# EAGLE design FreedomPort (EAGLE 9.6.2)
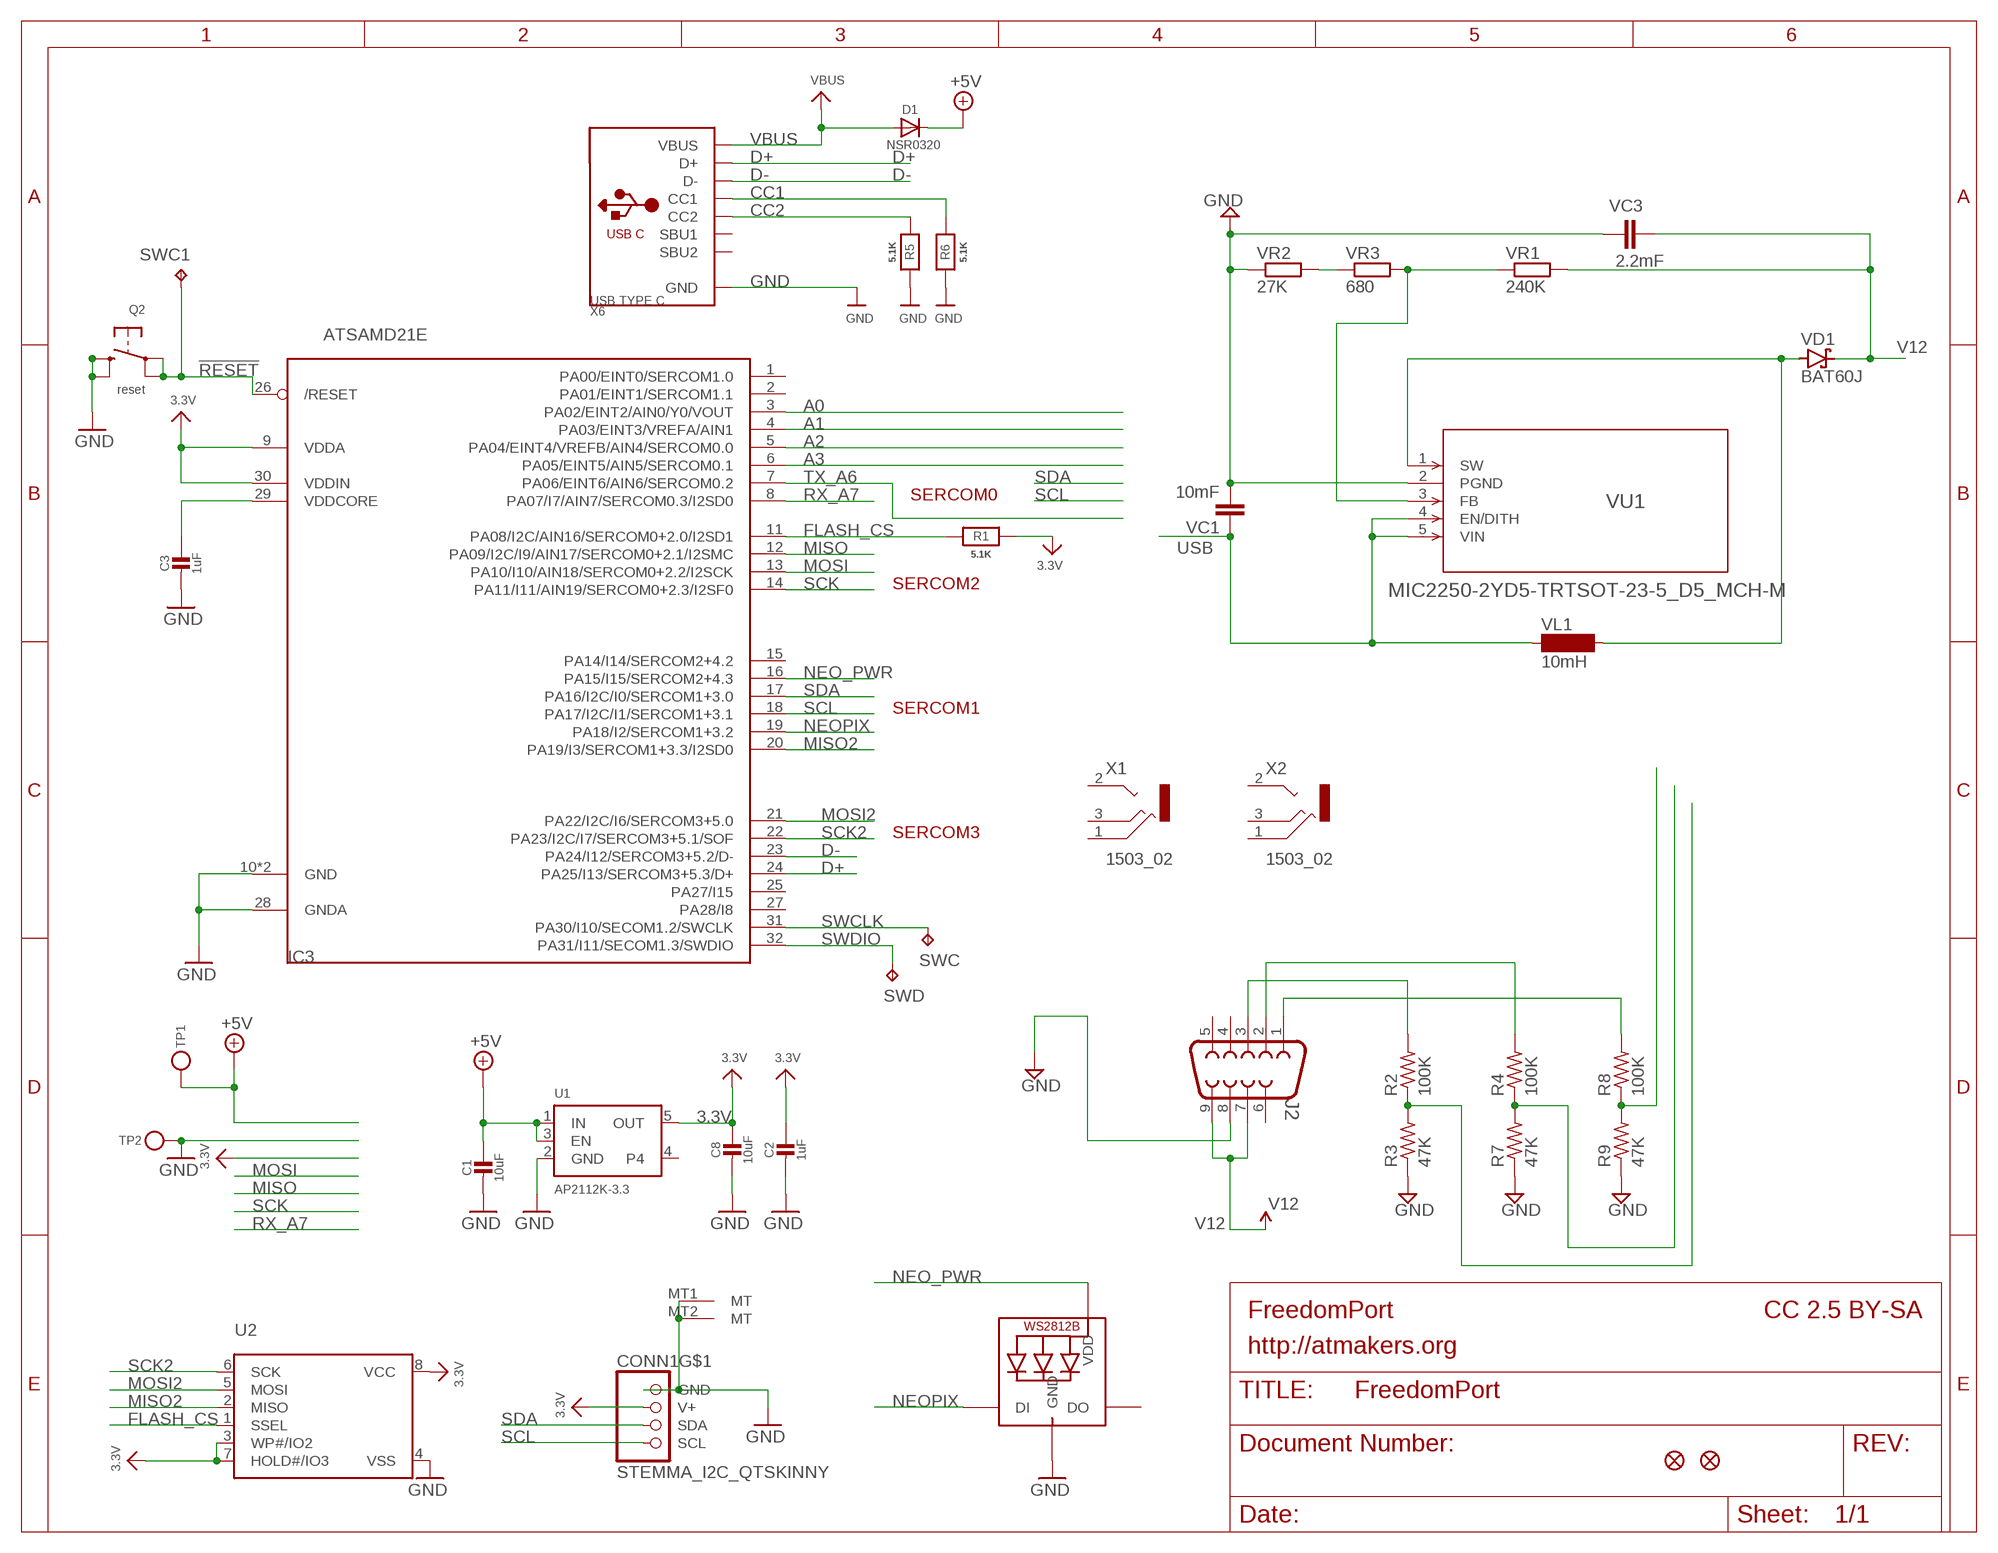
[diagram p0: schematic, sheet 1]

## Parts
C1  10uF  CAP_CERAMIC_0805MP  [_0805MP]
C2  1uF  CAP_CERAMIC_0402NO  [_0402NO]
C3  1uF  CAP_CERAMIC_0402NO  [_0402NO]
C8  10uF  CAP_CERAMIC_0805MP  [_0805MP]
CONN1  STEMMA_I2C_QTSKINNY  [JST_SH4_SKINNY]
D1  NSR0320  DIODE_SOD323MINI  [SOD-323_MINI]
IC3  ATSAMD21E  [QFN32_5MM]
J2  DB9MALE  [DB9_MALE]
LED1  WS2812B_SK6805_1515  [SK6805_1515]
Q2  reset  SWITCH_TACT_SMT4.6X2.8  [BTN_KMR2_4.6X2.8]
R1  5.1K  RESISTOR_0402NO  [_0402NO]
R2  100K  R-US_R0805  [R0805]
R3  47K  R-US_R0805  [R0805]
R4  100K  R-US_R0805  [R0805]
R5  5.1K  RESISTOR_0402NO  [_0402NO]
R6  5.1K  RESISTOR_0402NO  [_0402NO]
R7  47K  R-US_R0805  [R0805]
R8  100K  R-US_R0805  [R0805]
R9  47K  R-US_R0805  [R0805]
SWC  TPB1,27  [B1,27]
SWC1  TPB1,27  [B1,27]
SWD  TPB1,27  [B1,27]
TP1  TESTPOINT_1X3  [TESTPOINT_RECT_1X3MM]
TP2  TESTPOINT_1X3  [TESTPOINT_RECT_1X3MM]
U1  AP2112K-3.3  VREG_SOT23-5  [SOT23-5]
U2  SPIFLASH_8PIN  [SOIC8_150MIL]
U$6  FIDUCIAL_1MM  [FIDUCIAL_1MM]
U$8  FIDUCIAL_1MM  [FIDUCIAL_1MM]
VC1  10mF  C-EUC0805  [C0805]
VC3  2.2mF  C-EUC0805  [C0805]
VD1  BAT60J  [SOD323_ST]
VL1  10mH  MS50  [MS50]
VR1  240K  R-EU_R0805W  [R0805W]
VR2  27K  R-EU_R0805W  [R0805W]
VR3  680  R-EU_R0805W  [R0805W]
VU1  MIC2250-2YD5-TRTSOT-23-5_D5_MCH-M  [TSOT-23-5_D5_MCH-M]
X1  1503_02  [1503_02]
X2  1503_02  [1503_02]
X6  USB TYPE C  USB_C  [USB_C_CUSB31-CFM2AX-01-X]

## Nets
3.3V [power]: C2.1 C8.1 CONN1.2(V+) IC3.9(VDDA) IC3.30(VDDIN) R1.1 U1.5(OUT) U2.3(WP#/IO2) U2.7(HOLD#/IO3) U2.8(VCC)
!RESET: IC3.26(/RESET) Q2.A'(P1) Q2.A(P) SWC1.TP
+5V [power]: C1.1 D1.C TP1.P$1 U1.1(IN) U1.3(EN)
A0: IC3.3(PA02/EINT2/AIN0/Y0/VOUT)
A1: IC3.4(PA03/EINT3/VREFA/AIN1)
A2: IC3.5(PA04/EINT4/VREFB/AIN4/SERCOM0.0)
A3: IC3.6(PA05/EINT5/AIN5/SERCOM0.1)
CC1: R6.2 X6.A5(CC1)
CC2: R5.2 X6.B5(CC2)
D+: IC3.24(PA25/I13/SERCOM3+5.3/D+) X6.A6(D+) X6.B6(D+)
D-: IC3.23(PA24/I12/SERCOM3+5.2/D-) X6.A7(D-) X6.B7(D-)
FLASH_CS: IC3.11(PA08/I2C/AIN16/SERCOM0+2.0/I2SD1) R1.2 U2.1(SSEL)
GND [power]: C1.2 C2.2 C3.2 C8.2 CONN1.1(GND) CONN1.MT1(MT) CONN1.MT2(MT) IC3.10(GND) IC3.28(GNDA) IC3.33(GND) J2.8 LED1.4(GND) Q2.B'(S1) Q2.B(S) R3.1 R5.1 R6.1 R7.1 R9.1 TP2.P$1 U1.2(GND) U2.4(VSS) VC1.2 VC3.1 VR2.1 VU1.2(PGND) X6.A1B12(GND) X6.B1A12(GND)
MISO: IC3.12(PA09/I2C/I9/AIN17/SERCOM0+2.1/I2SMC)
MISO2: IC3.20(PA19/I3/SERCOM1+3.3/I2SD0) U2.2(MISO)
MOSI: IC3.13(PA10/I10/AIN18/SERCOM0+2.2/I2SCK)
MOSI2: IC3.21(PA22/I2C/I6/SERCOM3+5.0) U2.5(MOSI)
N$1: J2.3 R2.2
N$5: R2.1 R3.2
N$6: R4.1 R7.2
N$7: R8.1 R9.2
N$8: VR1.1 VR3.2 VU1.3(FB)
N$9: J2.2 R4.2
N$10: J2.1 R8.2
N$26: VD1.A VL1.2 VU1.1(SW)
N$31: VR2.2 VR3.1
NEO_PWR: IC3.16(PA15/I15/SERCOM2+4.3) LED1.2(VDD)
NEOPIX: IC3.19(PA18/I2/SERCOM1+3.2) LED1.1(DI)
RX_A7: IC3.8(PA07/I7/AIN7/SERCOM0.3/I2SD0)
SCK: IC3.14(PA11/I11/AIN19/SERCOM0+2.3/I2SF0)
SCK2: IC3.22(PA23/I2C/I7/SERCOM3+5.1/SOF) U2.6(SCK)
SCL: CONN1.4(SCL) IC3.18(PA17/I2C/I1/SERCOM1+3.1)
SDA: CONN1.3(SDA) IC3.17(PA16/I2C/I0/SERCOM1+3.0)
SWCLK: IC3.31(PA30/I10/SECOM1.2/SWCLK) SWC.TP
SWDIO: IC3.32(PA31/I11/SECOM1.3/SWDIO) SWD.TP
TX_A6: IC3.7(PA06/EINT6/AIN6/SERCOM0.2)
USB: VC1.1 VL1.1 VU1.4(EN/DITH) VU1.5(VIN)
V12: J2.7 J2.9 VC3.2 VD1.C VR1.2
VBUS [power]: D1.A X6.A4B9(VBUS) X6.B4A9(VBUS)
VDDCORE: C3.1 IC3.29(VDDCORE)
Unconnected: IC3.1(PA00/EINT0/SERCOM1.0) IC3.2(PA01/EINT1/SERCOM1.1) IC3.15(PA14/I14/SERCOM2+4.2) IC3.25(PA27/I15) IC3.27(PA28/I8) J2.4 J2.5 J2.6 LED1.3(DO) U1.4 X1.1 X1.2 X1.2@2 X1.3 X2.1 X2.2 X2.2@2 X2.3 X6.A8(SBU1) X6.B8(SBU2)

## Notes on the sheet
- SERCOM0
- SERCOM2
- SERCOM1
- SERCOM3
- FreedomPort | CC 2.5 BY-SA
- http://atmakers.org

## Library data of the parts
C1-C3 C8 = microbuilder:CAP_CERAMIC: Ceramic Capacitors For new designs, use the packages preceded by an '_' character since they are more reliable: The following footprints should be used on most boards: _0402 - Standard footprint for regular board layouts _0603 - Standard footprint for regular board layouts _0805 - Standard footprint for regular board layouts _1206 - Standard footprint for regular board layouts For extremely tight-pitch boards where space is at a premium, the following 'micro-pitch' footprints can be used (smaller pads, no silkscreen outline, etc.): _0402MP - Micro-pitch footprint for very dense/compact boards _0603MP - Micro-pitch footprint for very dense/compact boards _0805MP - Micro-pitch footprint for very dense/compact boards _1206MP - Micro-pitch footprint for very dense/compact boards
CONN1 = microbuilder:STEMMA_I2C
D1 = microbuilder:DIODE: Diode SMA Model Volts Amps Type Vf Ir Digikey # Notes SSA34-E3 40V 3A Schottky 480mV @ 3A 200uA @ 40V SSA34-E3/61TGITR-ND CDBA120-G 20V 1A Schottky 500mV @ 1A 500uA @ 20V 641-1014-6-ND REEL MBRA210 10V 2A Schottky 350mV @ 2A 700uA @ 10V MBRA210LT3 SOD-123 Model Volts Amps Type Vf Ir Order # Notes BAT54T1G 30V 200mA Schottky 800mV @ 200mA 2uA @ 25V BAT54T1GOSTR-ND B0530W 30V 500mA Schottky 430mV @ 500mA 130uA @ 30V B0530W-FDICT-ND REEL MBR120 20V 1A Schottky 340mV @ 1A MBR120VLSFT1GOSCT-ND SOD-323 Model Volts Amps Type Vf Ir Order # Notes PMEG2005EJ 20V 500mA Schottky 355mV @ 500mA 568-4110-1-ND ZLLS410 10V 570mA Schottky 380mV @ 570mA ZLLS410CT-ND 1N4148WS 75V 150mA Silicon/Simple 1V 1N4148WSFSCT-ND REEL SOD-523 Model Volts Amps Type Vf Ir Order # Notes BAT54XV2 30V 200mA Schottky 0.8V @ 100mA BAT54XV2CT-ND TB751S 30V 30mA Schottky RB751S-40TE61CT-ND SOT23-R/W (R = Solder Paste/Reflow Ovens, W = Hand-Soldering) Model Volts Amps Type Vf Ir Order # Notes BAT54FILM 40V 300mA Schottky 497-7162-1-ND POWERDI-5 Model Volts Amps Type Vf Ir Order # Notes PDS560 60V 5A Schottky 670mV @ 5A 150uA @ 60V PDS560DICT-ND
IC3 = adafruit_micro:ATSAMD21E
J2 = SparkFun-Connectors:DB9: DB9 Connector Standard DB9 (D-Sub 9) serial connector. Can be used for CAN bus as well as RS485 and RS232. Footprint production proven. Here is the female version connector we sell at SparkFun: 9 Pin Female Serial Connector - PCB Mount <https://www.sparkfun.com/products/429> (PRT-00429) This connector has been used on the following SparkFun products: SparkFun RS232 Shifter - SMD <https://www.sparkfun.com/products/449> (PRT-00449) SparkFun RS232 Shifter SMD (No DB9) <https://www.sparkfun.com/products/8780> (PRT-08780); PROD_ID: CONN-09904
LED1 = microbuilder:WS2812B
Q2 = microbuilder:SWITCH_TACT_SMT: SMT Tact Switches 6x6mm - Digikey: P12940SCT-ND KMR2 (4.6x2.8mm) - Digikey: 401-1426-1-ND EVQ-PQHB55 - Light Touch, 160GF (4.5x4.5mm) - Digikey: P8090SCT-ND KMT0 - KMT021 NGJ LHS (etc.) IP68/Waterproof - Digikey: CKN10289CT-ND
R1 R5 R6 = microbuilder:RESISTOR: Resistors For new designs, use the packages preceded by an '_' character since they are more reliable: The following footprints should be used on most boards: _0402 - Standard footprint for regular board layouts _0603 - Standard footprint for regular board layouts _0805 - Standard footprint for regular board layouts _1206 - Standard footprint for regular board layouts For extremely tight-pitch boards where space is at a premium, the following 'micro-pitch' footprints can be used (smaller pads, no silkscreen outline, etc.): _0402MP - Micro-pitch footprint for very dense/compact boards _0603MP - Micro-pitch footprint for very dense/compact boards _0805MP - Micro-pitch footprint for very dense/compact boards _1206MP - Micro-pitch footprint for very dense/compact boards
R2-R4 R7-R9 = adafruit:R-US_: RESISTOR, American symbol
SWC SWC1 SWD = testpad:TP: Test pad
TP1 TP2 = microbuilder:TESTPOINT: Test Point Various test points for characterisation and PCB testing TESTPOINT_SMT - Compact Surface Mount Test Point [Digikey: 5016KTR-ND]
U1 = adafruit_power:VREG_SOT23-5: SOT23-5 Fixed Voltage Regulators Part Current Out V Out V In V Dropout θJA (°C/W) TJ (°C) Digikey Part No. ADP121 150mA 3.3V 3.4-5.5V 0.09V @ 150mA -- -- ADP121-AUJZ33R7CT-ND ADP121 150mA 3.0V 3.1-5.5V 0.09V @ 150mA -- -- ADP121-AUJZ30R7CT-ND ADP122 300mA 3.3V 3.4-5.5V 0.085V @ 300mA -- -- ADP122AUJZ-3.3-R7CT-ND ADP1712 300mA 3.3V 3.5-5.5V 0.17V @ 300mA -- -- ADP1712AUJZ-3.3-R7TR-ND AP7311 (Low Cost) 150mA 3.3V 3.5-6V 0.15V @ 150mA -- -- AP7311-33WG-7DICT-ND LD39015M18R 150mA 1.8V 1.9V-5.5V 0.08V @ 100mA -- -- 497-6977-1-ND LP2985A-33DBVR 150mA 3.3V 3.3-16V 0.28V @ 150mA 206 150 296-18479-1-ND MCP1824T-3302E/OT 300mA 3.3V 3.5V-6V 0.2V @ 300mA -- -- MCP1824T-3302E/OTCT-ND MIC5205-2.5YM5 TR 150mA 2.5V 2.7-16V 0.165V @ 150mA -- -- 576-1257-2-ND MIC5205-3.0YM5 TR 150mA 3.0V 3.2V-16V 0.165V @ 150mA -- -- 576-1258-2-ND MIC5205-3.3YM5 TR 150mA 3.3V 3.5V-16V 0.165V @ 150mA -- -- 576-1259-2-ND TPS780330220 150mA 3.3V+2.2V 3.6-5.5V 250mV Max -- -- 296-23332-1-ND TDA3663/N1,135 100mA 3.3V 3.5-45V 0.18V @ 50mA -- -- 568-5343-1-ND Max operating temp can be calculated using θJA, TJ (max junction temperature), and power in watts. Set the "Maximum Ambient Temperature" until it reaches TJ ("Max Junction Temperature"), which is the absolute limit for safe use of the regulator: Heat Sink Temperature Calculator <http://www.daycounter.com/Calculators/Heat-Sink-Temperature-Calculator.phtml> For example, With 12V source into a 3.3V LP2985 and a 30mA load, we are dissipating (12V-3.3V) * 0.03A = 0.261W. With a θJA of 206 °C/W, a TJ of 150°C, and 261mW we can safely use the chip without a heat sink up to 75°C (=147.1°C Junction Temperature).
U2 = microbuilder:SPIFLASH_8PIN: SOIC8 SPI Flash Be careful with the size since SOIC8 flash comes in several 'widths' SOIC8 150 mil M25P16 - 16Mbit (2Mbit x 8) Serial Flash (75MHz SPI Bus), Supply: 2.7-3.6V Digikey: SOIC8 - M25P16-VMN6P-ND SOIC8 208 mil W25Q16BVSSIG - 16Mbit (2Mbit x 8) Serial Flash (104MHz SPI Bus), Supply: 2.7-3.6V Digikey: SOIC8 - W25Q16BVSSIG-ND
U$6 U$8 = microbuilder:FIDUCIAL: Fiducial Alignment Points Various fiducial points for machine vision alignment.; BOM: EXCLUDE
VC1 VC3 = rcl:C-EU: CAPACITOR, European symbol; SPICEPREFIX: C
VD1 = diode:BAT60J: Schottky barrier diode Source: www.st.com, BAT60J.pdf
VL1 = inductor-neosid:MS50: INDUCTOR SMD power inductor; OC_FARNELL: unknown; OC_NEWARK: unknown
VR1-VR3 = rcl:R-EU_: RESISTOR, European symbol; SPICEPREFIX: R
VU1 = ATMakers:MIC2250-2YD5-TR; BUILT_BY: EMA_Jessica; COPYRIGHT: Copyright (C) 2018 Accelerated Designs. All rights reserved; MANUFACTURER_PART_NUMBER: MIC2250-2YD5-TR; SOURCELIBRARY: Microchip_2019-08-23_2; VENDOR: Microchip
X1 X2 = con-lumberg:1503_02: Jack connectors according to JISC 6560, 3.5 mm Klinkeneinbaukupplung nach JISC 6560, 3,5 mm, 3-polig/stereo, abgewinkelte Ausführung, Surface-Mount-Technik (SMT) Source: http://www.lumberg.com/Produkte/PDFs/1503_02.pdf; OC_FARNELL: 1216979; OC_NEWARK: unknown
X6 = microbuilder:USB_C: USB Type-C USB 2.0 Connector

## Net classes
1 power: width 0.254 mm
2 gnd: width 0.254 mm

## Board
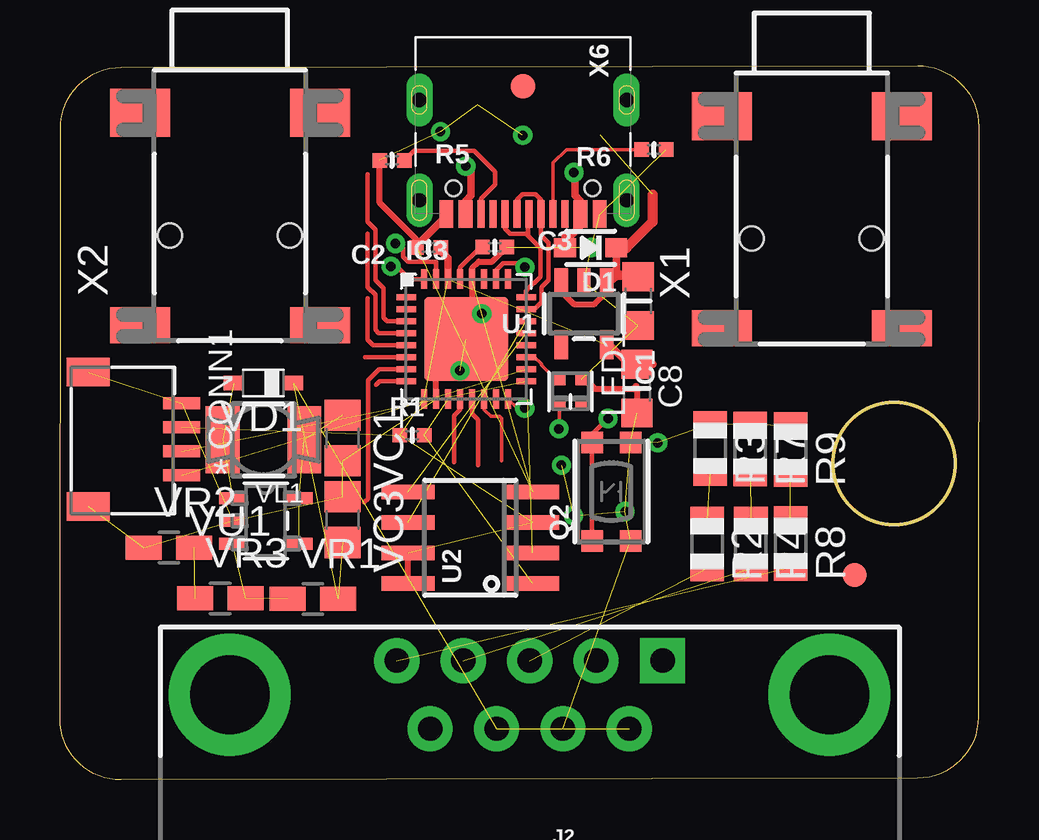
[diagram p1: board, top side]
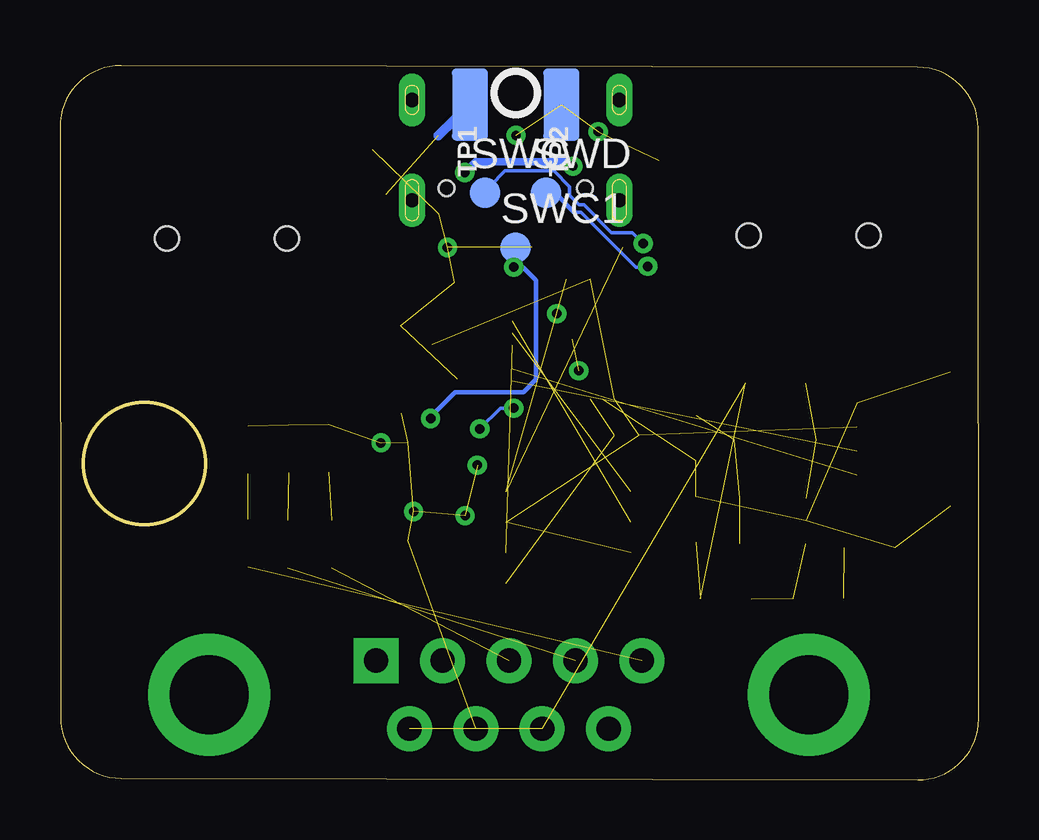
[diagram p2: board, bottom side, seen from below]

Size 38.3 x 29.76 mm. Coordinates in mm from the lower left corner, seen from the top.
Outline: 35.74,0.07 2.54,0 arc-90 0,2.54 0.02,27.16 arc-90 2.56,29.69 35.75,29.76 arc-90 38.3,27.22 38.28,2.6 arc-90 35.74,0.07
Outline: circle at 34.77,13.18 radius 2.54
Copper layers (1*16): Top 0.035mm / dielectric 1.5mm / Bottom 0.035mm
Design rules "adafruit 6-6": minimum track width 6mil, minimum drill 15.5mil, track to track 6mil, track to pad 6mil, pad to pad 6mil, via to via 6mil, smd to smd 6mil, copper to edge 10mil, drill to drill 8mil, minimum pad ring 10mil, minimum via ring 8mil, stop-mask expansion 2mil, vias tented up to drill 20mil, thermal gap 10mil

### Footprints (pad centres in the part's own frame; a part is rotated, then mirrored left to right if it is on the bottom)
_0805MP = smd 1.2 x 1.3: 1 -1.016,0; 2 1.016,0
_0402NO = smd 0.6 x 0.6: 1 -0.508,0; 2 0.508,0
JST_SH4_SKINNY = smd 0.5 x 1.55: 1 -1.5,2.514; 2 -0.5,2.514; 3 0.5,2.514; 4 1.5,2.514 | smd 1.2 x 1.8: MT1 -2.8,-1.386; MT2 2.8,-1.386
SOD-323_MINI = smd 0.9 x 0.8: A 1.07,0; C -1.07,0
QFN32_5MM = smd 0.8 x 0.25: 1 -2.5,1.75; 2 -2.5,1.25; 3 -2.5,0.75; 4 -2.5,0.25; 5 -2.5,-0.25; 6 -2.5,-0.75; 7 -2.5,-1.25; 8 -2.5,-1.75; 17 2.5,-1.75; 18 2.5,-1.25; 19 2.5,-0.75; 20 2.5,-0.25; 21 2.5,0.25; 22 2.5,0.75; 23 2.5,1.25; 24 2.5,1.75 | smd 0.25 x 0.8: 9 -1.75,-2.5; 10 -1.25,-2.5; 11 -0.75,-2.5; 12 -0.25,-2.5; 13 0.25,-2.5; 14 0.75,-2.5; 15 1.25,-2.5; 16 1.75,-2.5; 25 1.75,2.5; 26 1.25,2.5; 27 0.75,2.5; 28 0.25,2.5; 29 -0.25,2.5; 30 -0.75,2.5; 31 -1.25,2.5; 32 -1.75,2.5 | smd 3.5 x 3.5: 33 0,0
DB9_MALE = drill 1.016 pad 1.88: 1 5.54,-1.42; 2 2.77,-1.42; 3 0,-1.42; 4 -2.77,-1.42; 6 4.15,1.42; 7 1.38,1.42; 8 -1.38,1.42; 9 -4.15,1.42 | drill 1.016 pad 1.88 square: 5 -5.54,-1.42 | drill 3.302 pad 5.08: G1 -12.5,0; G2 12.5,0
SK6805_1515 = smd 0.5 x 0.5: 1 -0.5,-0.45; 2 0.5,-0.45; 3 0.5,0.45; 4 -0.5,0.45
BTN_KMR2_4.6X2.8 = smd 0.9 x 0.9: A 2.05,0.8; A' -2.05,0.8; B 2.05,-0.8; B' -2.05,-0.8
R0805 = smd 1.1 x 1.4: 1 -1,0; 2 1,0
B1,27 = smd 1.27 x 1.27: TP 0,0
TESTPOINT_RECT_1X3MM = smd 3 x 1.5: P$1 0,0
SOT23-5 = smd 0.55 x 1.2: 1 -0.95,-1.3; 2 0,-1.3; 3 0.95,-1.3; 4 0.95,1.3; 5 -0.95,1.3
SOIC8_150MIL = smd 0.6 x 2.2: 1 -1.905,-2.6; 2 -0.635,-2.6; 3 0.635,-2.6; 4 1.905,-2.6; 5 1.905,2.6; 6 0.635,2.6; 7 -0.635,2.6; 8 -1.905,2.6
FIDUCIAL_1MM = smd 1 x 1: 1 0,0
C0805 = smd 1.3 x 1.5: 1 -0.95,0; 2 0.95,0
SOD323_ST = smd 0.8 x 0.6: A 1.25,0; C -1.25,0
MS50 = smd 2.8 x 1.4: 1 0,-1.7; 2 0,1.7
R0805W = smd 1.5 x 1: 1 -1.052,0; 2 1.052,0
TSOT-23-5_D5_MCH-M = smd 1.156 x 0.508: 1 -1.378,0.95; 2 -1.378,0; 3 -1.378,-0.95; 4 1.378,-0.95; 5 1.378,0.95
1503_02 = smd 2.5 x 1.5: 1 -3.75,-10.75; 3 3.75,-10.75 | smd 2.5 x 2: 2 -3.75,-1.9; 2@2 3.75,-1.9 | hole 1: -2.5,-7; 2.5,-7
USB_C_CUSB31-CFM2AX-01-X = smd 0.575 x 1.15: A1B12 -3.2,3.545; A4B9 -2.4,3.545; B1A12 3.2,3.545; B4A9 2.4,3.545 | smd 0.275 x 1.15: A5 -1.25,3.545; A6 -0.25,3.545; A7 0.25,3.545; A8 1.25,3.545; B5 1.75,3.545; B6 0.75,3.545; B7 -0.75,3.545; B8 -1.75,3.545 | drill 0.6 pad 1 long: M1 -4.32,2.97; M2 4.32,2.97; M3 -4.32,-1.21; M4 4.32,-1.21 | hole 0.65: 2.89,2.47; -2.89,2.47

### Placement (x,y rotation side)
C1  24.1,19.95 270 top
C2  15.36,22.18 180 top
C3  18.12,22.19 0 top
C8  24.05,16.3 270 top
CONN1  2.56,14.19 270 top
D1  22.12,22.17 180 top
IC3  16.94,18.37 0 top
J2  19.58,3.55 180 top
LED1  21.28,16.19 270 top
Q2  22.98,12.01 90 top
R1  14.68,14.36 0 top
R2  26.97,9.82 270 top
R3  27.1,13.81 270 top
R4  28.8,9.82 270 top
R5  13.84,25.81 0 top
R6  24.76,26.26 180 top
R7  28.78,13.79 270 top
R8  30.45,9.85 270 top
R9  30.45,13.76 270 top
SWC  20.57,24.46 0 bottom
SWC1  19.3,22.17 0 bottom
SWD  18.03,24.46 0 bottom
TP1  21.21,28.14 270 bottom
TP2  17.4,28.14 270 bottom
U1  21.84,19.43 180 top
U2  17.1,10.09 90 top
U$6  33.12,8.53 0 top
U$8  19.3,28.9 0 top
U$11  [QTPY_BOT]  27.07,9.09 0 bottom
U$12  [PCBFEAT-REV-040]  19.3,28.62 0 bottom
U$13  [QTPY_TOP]  0,-0.01 0 top
VC1  11.78,14.24 270 top
VC3  11.78,10.84 270 top
VD1  8.48,16.53 180 top
VL1  8.48,14.17 90 top
VR1  10.54,7.54 0 top
VR2  4.54,9.67 0 top
VR3  6.68,7.56 0 top
VU1  8.58,10.79 0 top
X1  31.34,29.56 0 top
X2  7.08,29.69 0 top
X6  19.3,27.12 180 top

### Tracks (layer width: path | path; a pad name or v marks a point on that pad's centre or on a via)
3.3V  (6 unrouted)
  Top 0.254: U2.8 U2.7
  Top 0.305: IC3.30 16.19,21.73 15.87,22.04 C2.1 | U1.5 22.91,18.13 23.71,17.32 C8.1 24.71,17.32
!RESET  (via drill 0.39)
  Top 0.178: IC3.26 18.19,21.23 18.48,21.52 19.22,21.52 v19.38,21.36 | 22.01,14.24 22.12,14.12 | 22.12,14.12 Q2.A Q2.A' | v22.84,15.06 22.12,14.34 22.12,14.12
  Bottom 0.178: v19.38,21.36 18.99,21.36 18.45,20.82 18.45,16.68 18.98,16.15 21.83,16.15 22.84,15.13 v22.84,15.06
  Bottom 0.203: SWC1.TP 19.3,21.44 v19.38,21.36
+5V  (1 unrouted)
  Top 0.254: U1.3 20.89,20.35 21.42,19.82 22.29,19.82 22.79,20.32 U1.1
  Top 0.305: U1.1 23.19,21.13 D1.C
  Top 0.406: C1.1 23.15,21.01 U1.1 | 24.7,24.39 24.7,23.25 23.62,22.17 D1.C
  Bottom 0.406: 22.53,26.85 TP1.P$1
A0
  Top 0.178: IC3.3 13.63,19.12 13.48,19.26 13.48,20.48 13.15,20.81 13.15,22.92 12.82,23.25 12.82,25.24
A1
  Top 0.178: IC3.4 13.28,18.62 13.15,18.74 13.15,20.21 12.82,20.53 12.82,22.75
A2
  Top 0.178: 12.82,20.06 12.82,18.34 13.04,18.12 IC3.5
A3
  Top 0.178: 12.71,17.62 IC3.6
CC1
  Top 0.152: X6.A5 20.55,25.7 21.1,26.26 R6.2
CC2
  Top 0.178: R5.2 14.75,26.22 17.26,26.22 18.13,25.34 18.13,24.79 17.55,24.21 X6.B5
D+
  Top 0.178: IC3.24 19.44,20.38 20.02,20.97 20.02,22.16 19.5,22.68 | 19.5,22.68 19.5,23.53 X6.A6 | X6.B6 18.55,22.96 18.77,22.75 19.43,22.75 19.5,22.68
D-
  Top 0.178: X6.A7 19.05,24.18 19.28,24.4 19.82,24.4 20.05,24.17 X6.B7 20.05,22.69 20.36,22.38 20.36,20.81 20.08,20.53 20.08,19.89 19.81,19.62 IC3.23
FLASH_CS  (2 unrouted)
GND  (via drill 0.39)  (29 unrouted)
  Top 0.254: C3.2 18.41,21.98 18.4,21.98 18.02,21.6 17.46,21.6 17.19,21.32 IC3.28 17.19,18.62 IC3.33 | IC3.10 15.69,17.12 IC3.33 | C2.2 14.86,22.51 13.33,24.04 R5.1 | IC3.33 16.94,18.78 v17.59,19.43 | LED1.4 21.94,16.69 22.33,16.29 23.89,16.29 24,16.4 24.03,16.4 24.05,16.38 C8.2
  Top 0.305: X6.B1A12 16.1,23.49 14.86,22.24 C2.2
  other vias: 24.92,14.04 15.86,27.01 22.15,22.18 19.29,26.86 23.56,11.18 21.41,11.01 16.67,17.05 20.9,13.11
MISO
  Top 0.178: IC3.12 16.69,15.43 16.43,15.17 16.43,13.23
MISO2  (1 unrouted)
MOSI
  Top 0.178: IC3.13 17.17,15.85 17.17,15.26 17.43,15 17.43,13.11
MOSI2  (1 unrouted)
N$1  (1 unrouted)
N$5  (1 unrouted)
N$6  (1 unrouted)
N$7  (1 unrouted)
N$8  (2 unrouted)
N$9  (1 unrouted)
N$10  (1 unrouted)
N$26  (2 unrouted)
N$31  (1 unrouted)
NEO_PWR  (via drill 0.39)
  Top 0.152: IC3.16 19.06,15.49 v19.38,15.49 | LED1.2 20.83,14.62 v20.8,14.62
  Bottom 0.152: v20.8,14.62 19.94,15.49 v19.38,15.49
NEOPIX
  Top 0.152: LED1.1 20.83,16.7 20.65,16.89 20.44,16.89 20.07,17.27 20.07,17.34 19.79,17.62 IC3.19
RX_A7
  Top 0.178: IC3.8 13.33,16.62 13.17,16.45
SCK
  Top 0.152: IC3.14 17.69,15.43 17.97,15.15 18.32,15.15 18.4,15.06 18.4,13.29
SCK2  (1 unrouted)
SCL  (1 unrouted)
SDA  (1 unrouted)
SWCLK  (via drill 0.39)
  Top 0.178: IC3.31 15.69,21.6 14.5,21.6 14.31,21.79 14.31,22.17 14.14,22.35 v13.99,22.35
  Bottom 0.152: v13.99,22.35 14.44,22.8 15.3,22.8 16.46,23.96 16.67,23.96 17.07,24.35 17.07,24.72 17.71,25.37 19.75,25.37 20.38,24.73 SWC.TP
SWDIO  (via drill 0.39)
  Top 0.178: IC3.32 14.57,20.87 14.04,21.39 v13.8,21.39
  Bottom 0.152: v13.8,21.39 13.82,21.37 14.3,21.37 16.58,23.65 16.86,23.65
  Bottom 0.178: SWD.TP 17.66,24.45 16.86,23.65
TX_A6
  Top 0.178: IC3.7 13.3,17.12 12.84,16.66 12.84,11.72 12.68,11.56
USB  (3 unrouted)
V12  (4 unrouted)
VBUS  (via drill 0.39)
  Top 0.305: D1.A 21.05,22.6 21.14,22.7 21.32,22.7 21.7,23.08 X6.A4B9 21.7,24.11 21.46,24.35 21.46,25.27 v21.42,25.31 | X6.B4A9 16.9,24.11 17.14,24.35 17.14,25.34 v16.91,25.57
  Bottom 0.305: v21.42,25.31 20.98,25.75 17.09,25.75 v16.91,25.57
VDDCORE
  Top 0.178: IC3.29 16.69,21.36 17.52,22.19 C3.1